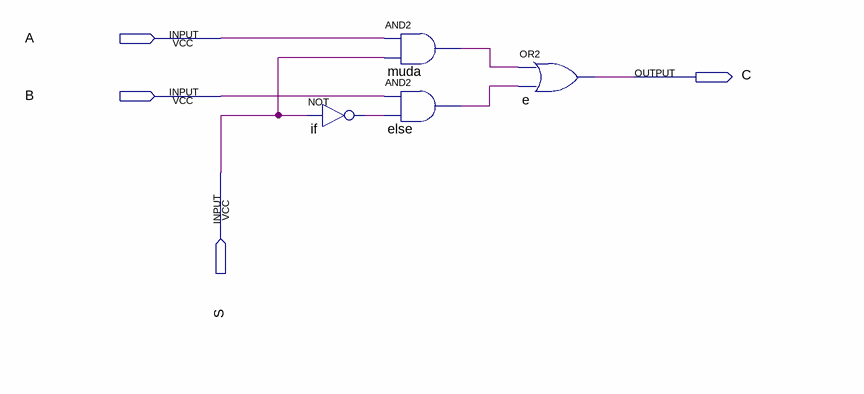
[diagram p0: schematic sheet]
// Quartus schematic MUX2.bdf as structural Verilog: 4 symbols, 4 pins
module MUX2 (
  input  A,
  input  B,
  input  S,
  output C
);

  wire else_out, if_out, muda_out;

  not \if  (if_out, S);
  and muda (muda_out, A, S);
  and \else  (else_out, B, if_out);
  or e (C, muda_out, else_out);
endmodule
